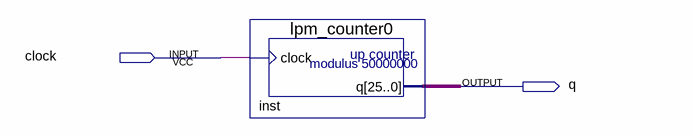
[diagram p0: schematic sheet]
// Quartus schematic counter.bdf as structural Verilog: 1 symbols, 2 pins
module counter (
  input  clock,
  output q
);

  wire [25:0] inst_q;

  lpm_counter0 inst (.clock(clock), .q(inst_q));
endmodule
